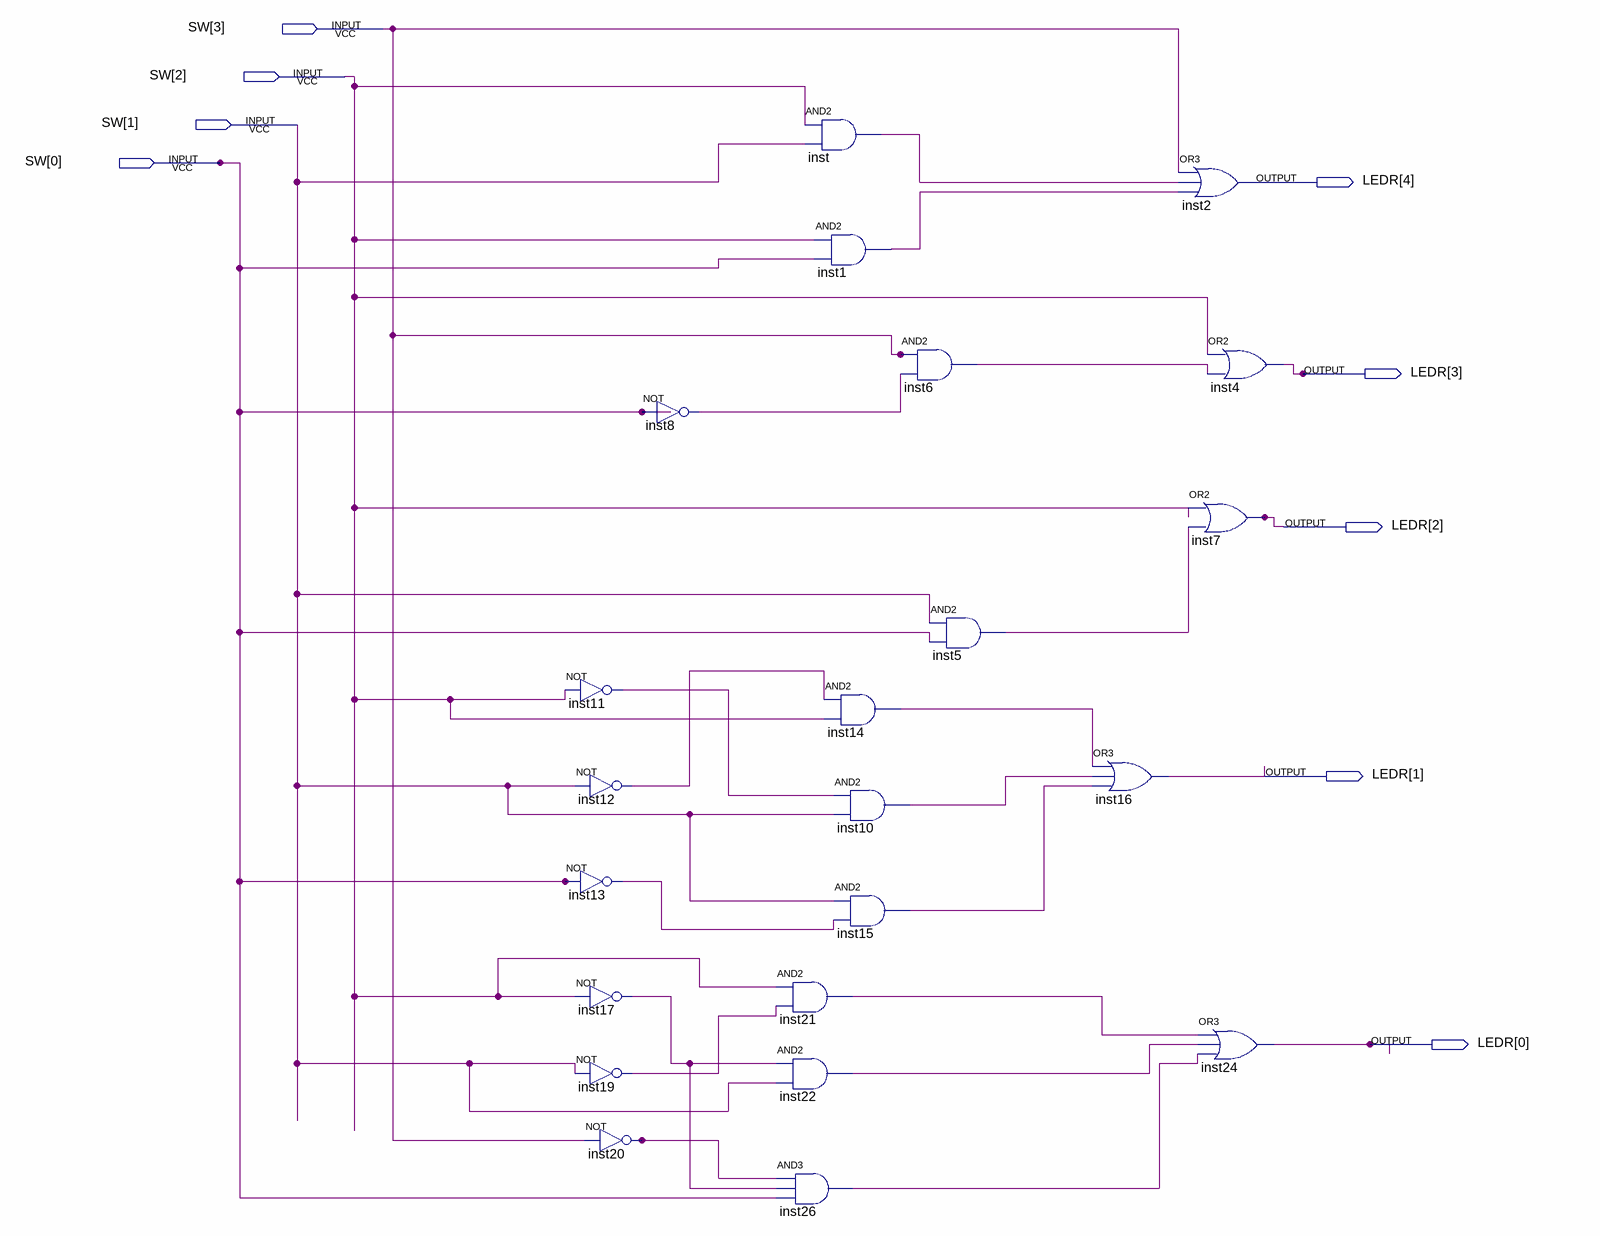
[diagram p0: schematic sheet]
// Quartus schematic minimo.bdf as structural Verilog: 22 symbols, 9 pins
module minimo (
  input  [3:0] SW,
  output [4:0] LEDR
);

  wire inst1_out, inst5_out, inst6_out, inst8_out, inst10_out, inst11_out, inst12_out, inst13_out,
       inst14_out, inst15_out, inst17_out, inst19_out, inst20_out, inst21_out, inst22_out, inst26_out,
       inst_out;

  not inst11 (inst11_out, SW[2]);
  not inst12 (inst12_out, SW[1]);
  not inst13 (inst13_out, SW[0]);
  not inst17 (inst17_out, SW[2]);
  not inst19 (inst19_out, SW[1]);
  not inst20 (inst20_out, SW[3]);
  not inst8 (inst8_out, SW[0]);
  and inst21 (inst21_out, SW[2], inst19_out);
  and inst22 (inst22_out, inst17_out, SW[1]);
  and inst26 (inst26_out, inst20_out, inst17_out, SW[0]);
  and inst (inst_out, SW[2], SW[1]);
  and inst1 (inst1_out, SW[2], SW[0]);
  and inst14 (inst14_out, inst12_out, SW[2]);
  and inst10 (inst10_out, inst11_out, SW[1]);
  and inst15 (inst15_out, SW[1], inst13_out);
  and inst6 (inst6_out, SW[3], inst8_out);
  and inst5 (inst5_out, SW[1], SW[0]);
  or inst16 (LEDR[1], inst14_out, inst10_out, inst15_out);
  or inst2 (LEDR[4], SW[3], inst_out, inst1_out);
  or inst4 (LEDR[3], SW[2], inst6_out);
  or inst7 (LEDR[2], SW[2], inst5_out);
  or inst24 (LEDR[0], inst21_out, inst22_out, inst26_out);
endmodule
